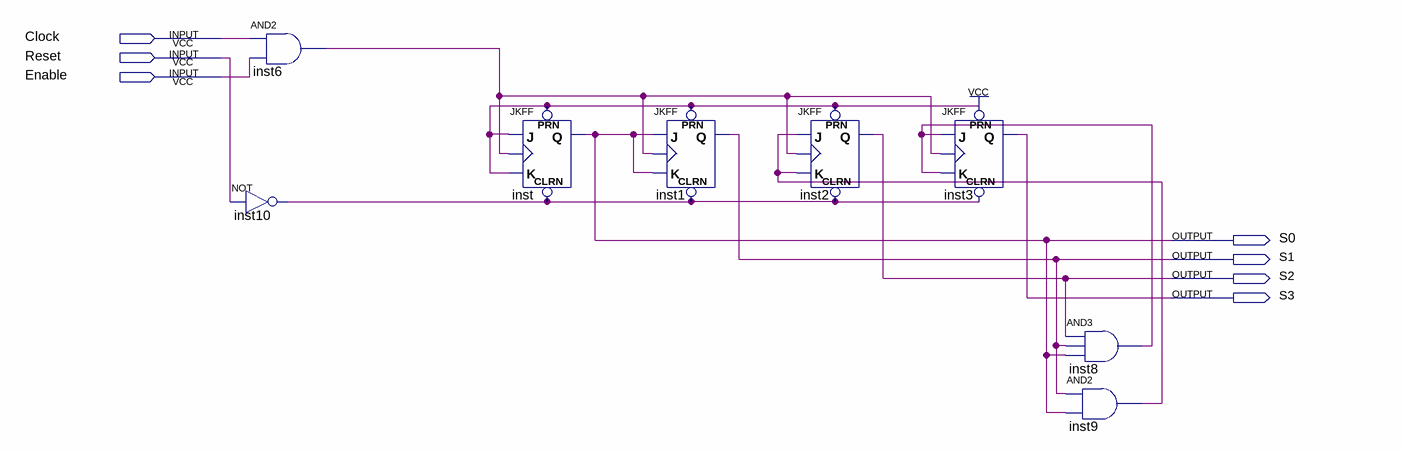
[diagram p0: schematic sheet]
// Quartus schematic Cont_sinc_0_F.bdf as structural Verilog: 8 symbols, 7 pins
module Cont_sinc_0_F (
  input  Clock,
  input  Reset,
  input  Enable,
  output S0,
  output S1,
  output S2,
  output S3
);

  wire inst6_out, inst8_out, inst9_out, inst10_out;

  and inst6 (inst6_out, Clock, Enable);
  not inst10 (inst10_out, Reset);
  JKFF inst (.PRN(1'b1), .CLRN(inst10_out), .K(1'b1), .J(1'b1), .CLK(inst6_out), .Q(S0));
  JKFF inst1 (.PRN(1'b1), .CLRN(inst10_out), .K(S0), .J(S0), .CLK(inst6_out), .Q(S1));
  JKFF inst2 (.PRN(1'b1), .CLRN(inst10_out), .K(inst9_out), .J(inst9_out), .CLK(inst6_out), .Q(S2));
  JKFF inst3 (.PRN(1'b1), .CLRN(inst10_out), .K(inst8_out), .J(inst8_out), .CLK(inst6_out), .Q(S3));
  and inst8 (inst8_out, S2, S1, S0);
  and inst9 (inst9_out, S1, S0);
endmodule
